# Altium schematic sheet Power.SchDoc (part 2 of 2)
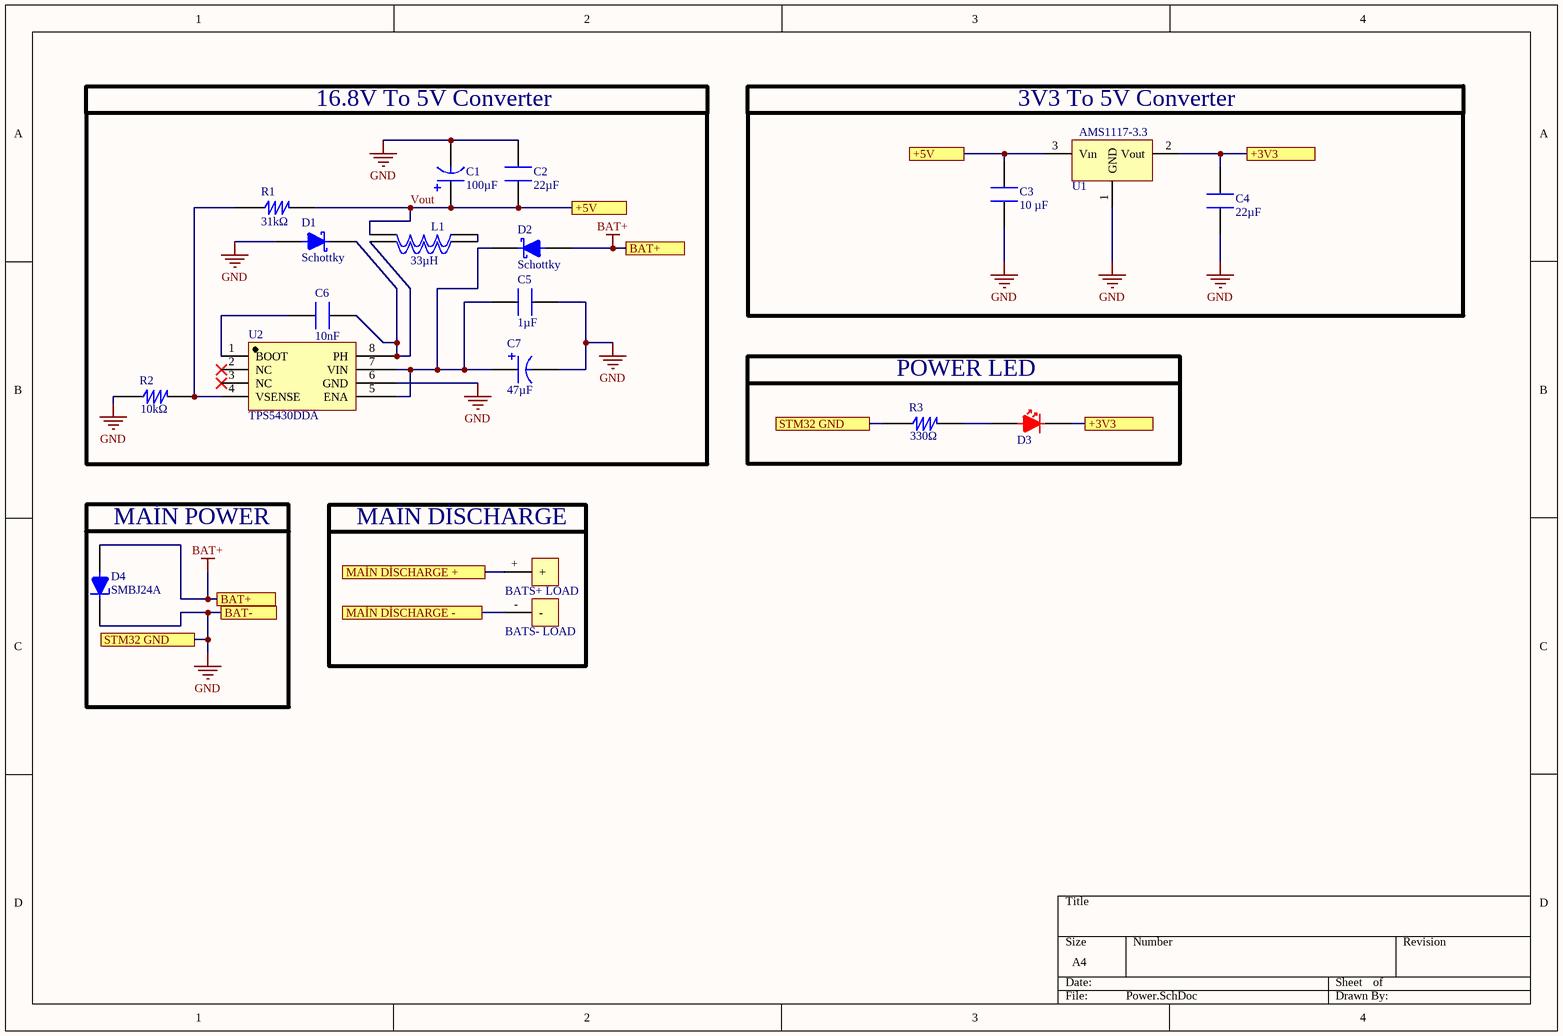
[diagram p1: Power.SchDoc]

## Library data of the parts (continued)
R2 = RES 10K OHM 1/10W 0603: RES 10K OHM 1% 1/10W 0603; Manufacturer: Stackpole Electronics; Max Power Dissipation: 100mW; Temperature Coefficient: 100ppm/°C; Voltage Rating: 75V; Supplier: Arrow Electronics; Supplier Part Number: RMCF0603FT10K0; Manufacturer Part Number: RMCF0603FT10K0; RoHS: Compliant; Category: Chip SMD Resistors; Stock: 2390000; Pricing: 50000=0,0018 (USD); Case/Package: 0603; Case Code (Imperial): 0603; Case Code (Metric): 1608; China RoHS: Non-Compliant; Composition: Thick Film; Contact Plating: Tin; Depth: 800µm; Features: Automotive AEC-Q200; Height: 450µm; Lead Free: Lead Free; Length: 1.55mm; Lifecycle Status: Production; Max Operating Temperature: 155°C; Military Standard: Not; Min Operating Temperature: -55°C; Mounting Technology: Surface Mount; Number of Terminals: 2; Number of Terminations: 2; Packaging: Cut Tape (CT); Power Dissipation: 100mW; Power Rating: 100mW; Radiation Hardening: No; REACH SVHC: Yes; Schedule B: 8533210045, 8533210045|8533210045, 8533210045|8533210045|8533210045, 8533210045|8533210045|8533210045|8533210045; Tolerance: 1%; Width: 800µm; Working Voltage: 75V; ComponentLink1URL: https://datasheet.octopart.com:443/RMCF0603FT10K0-Stackpole-Electronics-datasheet-182148065.pdf?src-supplier=IHS; ComponentLink1Description: https://datasheet.octopart.com:443/RMCF0603FT10K0-Stackpole-Electronics-datasheet-182148065.pdf?src-supplier=IHS; ComponentLink2URL: https://datasheet.octopart.com:443/RMCF0603FT10K0-Stackpole-Electronics-datasheet-28504820.pdf?src-supplier=Upverter; ComponentLink2Description: https://datasheet.octopart.com:443/RMCF0603FT10K0-Stackpole-Electronics-datasheet-28504820.pdf?src-supplier=Upverter; ComponentLink3URL: https://datasheet.octopart.com:443/RMCF0603FT10K0-Stackpole-Electronics-datasheet-141193804.pdf?src-supplier=Stackpole+Electronics; ComponentLink3Description: https://datasheet.octopart.com:443/RMCF0603FT10K0-Stackpole-Electronics-datasheet-141193804.pdf?src-supplier=Stackpole+Electronics; ComponentLink4URL: https://datasheet.octopart.com:443/RMCF0603FT10K0-Stackpole-Electronics-datasheet-62091608.pdf?src-supplier=Stackpole+Electronics; ComponentLink4Description: https://datasheet.octopart.com:443/RMCF0603FT10K0-Stackpole-Electronics-datasheet-62091608.pdf?src-supplier=Stackpole+Electronics; ComponentLink5URL: https://datasheet.octopart.com:443/RMCF0603FT10K0-Stackpole-Electronics-datasheet-12534581.pdf?src-supplier=Stackpole+Electronics; ComponentLink5Description: https://datasheet.octopart.com:443/RMCF0603FT10K0-Stackpole-Electronics-datasheet-12534581.pdf?src-supplier=Stackpole+Electronics; ComponentLink6URL: https://datasheet.octopart.com:443/RMCF0603FT10K0-Stackpole-Electronics-datasheet-10788263.pdf?src-supplier=Stackpole+Electronics; ComponentLink6Description: https://datasheet.octopart.com:443/RMCF0603FT10K0-Stackpole-Electronics-datasheet-10788263.pdf?src-supplier=Stackpole+Electronics; ComponentLink7URL: https://datasheet.octopart.com:443/RMCF0603FT10K0-Stackpole-Electronics-datasheet-155966809.pdf?src-supplier=Electro+Sonic; ComponentLink7Description: https://datasheet.octopart.com:443/RMCF0603FT10K0-Stackpole-Electronics-datasheet-155966809.pdf?src-supplier=Electro+Sonic; ComponentLink8URL: https://datasheet.octopart.com:443/RMCF0603FT10K0-Stackpole-Electronics-datasheet-189104164.pdf?src-supplier=Master+Electronics; ComponentLink8Description: https://datasheet.octopart.com:443/RMCF0603FT10K0-Stackpole-Electronics-datasheet-189104164.pdf?src-supplier=Master+Electronics; ComponentLink9URL: https://datasheet.octopart.com:443/RMCF0603FT10K0-Stackpole-Electronics-datasheet-154799224.pdf?src-supplier=Master+Electronics; ComponentLink9Description: https://datasheet.octopart.com:443/RMCF0603FT10K0-Stackpole-Electronics-datasheet-154799224.pdf?src-supplier=Master+Electronics; ComponentLink10URL: https://datasheet.octopart.com:443/RMCF0603FT10K0-Stackpole-Electronics-datasheet-11546843.pdf?src-supplier=Arrow+Electronics; ComponentLink10Description: https://datasheet.octopart.com:443/RMCF0603FT10K0-Stackpole-Electronics-datasheet-11546843.pdf?src-supplier=Arrow+Electronics; ComponentLink11URL: https://datasheet.octopart.com:443/RMCF0603FT10K0-Stackpole-Electronics-datasheet-11547379.pdf?src-supplier=Future+Electronics; ComponentLink11Description: https://datasheet.octopart.com:443/RMCF0603FT10K0-Stackpole-Electronics-datasheet-11547379.pdf?src-supplier=Future+Electronics; ComponentLink12URL: https://datasheet.octopart.com:443/RMCF0603FT10K0-Stackpole-Electronics-datasheet-8359789.pdf?src-supplier=Future+Electronics; ComponentLink12Description: https://datasheet.octopart.com:443/RMCF0603FT10K0-Stackpole-Electronics-datasheet-8359789.pdf?src-supplier=Future+Electronics; ComponentLink13URL: https://datasheet.octopart.com:443/RMCF0603FT10K0-Stackpole-Electronics-datasheet-8324226.pdf?src-supplier=Future+Electronics; ComponentLink13Description: https://datasheet.octopart.com:443/RMCF0603FT10K0-Stackpole-Electronics-datasheet-8324226.pdf?src-supplier=Future+Electronics; ComponentLink14URL: http://sigma.octopart.com:80/15940719/materials_sheet/Stackpole-Electronics-RMCF0603FT10K0.pdf?src-supplier=Compliance+Statements; ComponentLink14Description: http://sigma.octopart.com:80/15940719/materials_sheet/Stackpole-Electronics-RMCF0603FT10K0.pdf?src-supplier=Compliance+Statements; ComponentLink15URL: http://sigma.octopart.com:80/141158211/reach_statement/Stackpole-Electronics-RMCF0603FT10K0.pdf?src-supplier=Compliance+Statements; ComponentLink15Description: http://sigma.octopart.com:80/141158211/reach_statement/Stackpole-Electronics-RMCF0603FT10K0.pdf?src-supplier=Compliance+Statements; ComponentLink16URL: http://sigma.octopart.com:80/141158212/rohs_statement/Stackpole-Electronics-RMCF0603FT10K0.pdf?src-supplier=Compliance+Statements; ComponentLink16Description: http://sigma.octopart.com:80/141158212/rohs_statement/Stackpole-Electronics-RMCF0603FT10K0.pdf?src-supplier=Compliance+Statements
R3 = RES 330 OHM 1/10W 0603: 330 Ohms ±1% 0.1W, 1/10W Chip Resistor 0603 (1608 Metric) Thick Film; Manufacturer: TE Connectivity; Manufacturer Part Number: 1622918-1; Manufacturer Lifecycle Status: ACTIVE; Number of Resistors: 1; Operating Supply Voltage: 50V; Power Dissipation: 100mW; Temperature Coefficient: 100ppm/°C; Supplier: Farnell; Supplier Part Number: 3399578; RoHS: Compliant; Category: Chip SMD Resistors; Stock: 16155; Pricing: 10=0,0125, 250=0,0066, 1000=0,0044, 5000=0,0038, 10000=0,0028, 20000=0,0027 (EUR); Case/Package: 0603; Case Code (Imperial): 0603; Case Code (Metric): 1608; China RoHS: Non-Compliant; Composition: Thick Film; Depth: 800µm; ELV: Compliant; Height: 450µm; Length: 1.6mm; Lifecycle Status: Production; Max Operating Temperature: 125°C; Min Operating Temperature: -55°C; Mounting Technology: Surface Mount; Number of Terminals: 2; Number of Terminations: 2; Packaging: Tape & Reel (TR); Power Rating: 100mW; Radiation Hardening: No; REACH SVHC: Yes; Schedule B: 8533210045, 8533210090, 8533210090|8533210090, 8533210090|8533210090|8533210090; Termination: Solder; Tolerance: 1%; Voltage Rating: 50V; Width: 800µm; Working Voltage: 50V; ComponentLink1URL: https://datasheet.octopart.com:443/1622918-1-TE-Connectivity-datasheet-177732131.pdf?src-supplier=JRH+Electronics; ComponentLink1Description: https://datasheet.octopart.com:443/1622918-1-TE-Connectivity-datasheet-177732131.pdf?src-supplier=JRH+Electronics; ComponentLink2URL: https://datasheet.octopart.com:443/1622918-1-TE-Connectivity-datasheet-11120284.pdf?src-supplier=Farnell; ComponentLink2Description: https://datasheet.octopart.com:443/1622918-1-TE-Connectivity-datasheet-11120284.pdf?src-supplier=Farnell; ComponentLink3URL: https://datasheet.octopart.com:443/CRG0603F330R-TE-Connectivity-datasheet-182172479.pdf?src-supplier=IHS; ComponentLink3Description: https://datasheet.octopart.com:443/CRG0603F330R-TE-Connectivity-datasheet-182172479.pdf?src-supplier=IHS; ComponentLink4URL: https://datasheet.octopart.com:443/1622918-1-TE-Connectivity---AMP-datasheet-11120141.pdf?src-supplier=Master+Electronics; ComponentLink4Description: https://datasheet.octopart.com:443/1622918-1-TE-Connectivity---AMP-datasheet-11120141.pdf?src-supplier=Master+Electronics; ComponentLink5URL: https://datasheet.octopart.com:443/1622918-1-TE-Connectivity---AMP-datasheet-128558484.pdf?src-supplier=Master+Electronics; ComponentLink5Description: https://datasheet.octopart.com:443/1622918-1-TE-Connectivity---AMP-datasheet-128558484.pdf?src-supplier=Master+Electronics; ComponentLink6URL: https://datasheet.octopart.com:443/1622918-1-TE-Connectivity---AMP-datasheet-189108518.pdf?src-supplier=Master+Electronics; ComponentLink6Description: https://datasheet.octopart.com:443/1622918-1-TE-Connectivity---AMP-datasheet-189108518.pdf?src-supplier=Master+Electronics; ComponentLink7URL: https://datasheet.octopart.com:443/1622918-1-TE-Connectivity---AMP-datasheet-44624597.pdf?src-supplier=TE+Connectivity; ComponentLink7Description: https://datasheet.octopart.com:443/1622918-1-TE-Connectivity---AMP-datasheet-44624597.pdf?src-supplier=TE+Connectivity; ComponentLink8URL: https://datasheet.octopart.com:443/1622918-1-TE-Connectivity-datasheet-14513272.pdf?src-supplier=TE+Connectivity; ComponentLink8Description: https://datasheet.octopart.com:443/1622918-1-TE-Connectivity-datasheet-14513272.pdf?src-supplier=TE+Connectivity; ComponentLink9URL: https://datasheet.octopart.com:443/1622918-1-TE-Connectivity-datasheet-177731251.pdf?src-supplier=Burklin+Elektronik; ComponentLink9Description: https://datasheet.octopart.com:443/1622918-1-TE-Connectivity-datasheet-177731251.pdf?src-supplier=Burklin+Elektronik; ComponentLink10URL: https://datasheet.octopart.com:443/CRG0603F330R-TE-Connectivity-datasheet-111046813.pdf?src-supplier=RS+(Formerly+Allied+Electronics); ComponentLink10Description: https://datasheet.octopart.com:443/CRG0603F330R-TE-Connectivity-datasheet-111046813.pdf?src-supplier=RS+(Formerly+Allied+Electronics); ComponentLink11URL: https://datasheet.octopart.com:443/CRG0603F330R-TE-Connectivity-datasheet-20739855.pdf?src-supplier=RS+(Formerly+Allied+Electronics); ComponentLink11Description: https://datasheet.octopart.com:443/CRG0603F330R-TE-Connectivity-datasheet-20739855.pdf?src-supplier=RS+(Formerly+Allied+Electronics); ComponentLink12URL: https://datasheet.octopart.com:443/CRG0603F330R-Tyco-Electronics-datasheet-9643492.pdf?src-supplier=RS+(Formerly+Allied+Electronics); ComponentLink12Description: https://datasheet.octopart.com:443/CRG0603F330R-Tyco-Electronics-datasheet-9643492.pdf?src-supplier=RS+(Formerly+Allied+Electronics); ComponentLink13URL: http://sigma.octopart.com:80/14513267/rohs_certificate/Tyco-Electronics-CRG0603F330R.pdf?src-supplier=Compliance+Statements; ComponentLink13Description: http://sigma.octopart.com:80/14513267/rohs_certificate/Tyco-Electronics-CRG0603F330R.pdf?src-supplier=Compliance+Statements; ComponentLink14URL: http://sigma.octopart.com:80/38872715/materials_sheet/TE-Connectivity-CRG0603F330R.pdf?src-supplier=Compliance+Statements; ComponentLink14Description: http://sigma.octopart.com:80/38872715/materials_sheet/TE-Connectivity-CRG0603F330R.pdf?src-supplier=Compliance+Statements; ComponentLink15URL: http://sigma.octopart.com:80/78339115/materials_sheet/TE-Connectivity-CRG0603F330R.pdf?src-supplier=Compliance+Statements; ComponentLink15Description: http://sigma.octopart.com:80/78339115/materials_sheet/TE-Connectivity-CRG0603F330R.pdf?src-supplier=Compliance+Statements
U1 = AMS1117-3.3: IC REG LINEAR 3.3V 1A SOT-223-3L; Manufacturer: ams; Max Junction Temperature (Tj): 125°C; Number of Circuits: 1; Voltage Tolerance: 3%; Supplier: Bison Technologies; RoHS: Compliant; Category: LDO Voltage Regulators; Stock: 375; Pricing: 100=0,1, 1000=0,1, 10000=0,1 (USD); Height - Seated (Max): 1.8mm; Length: 6.505mm; Number of Terminals: 3; REACH SVHC: Yes; Terminal Pitch: 2.29mm; Width: 3.505mm; ComponentLink1URL: https://datasheet.octopart.com:443/AMS1117-3.3-ams-datasheet-31830847.pdf?src-supplier=IHS; ComponentLink1Description: https://datasheet.octopart.com:443/AMS1117-3.3-ams-datasheet-31830847.pdf?src-supplier=IHS; Manufacturer Part Number: AMS1117-3.3
U2 = TPS5430DDA: 5.5V to 36V Input, 3A, 500kHz Step-Down Converter 8-SO PowerPAD 0 to 0; Manufacturer: Texas Instruments; Manufacturer Lifecycle Status: ACTIVE; Efficiency: 95%; Frequency: 600kHz; Max Duty Cycle: 89%; Max Junction Temperature (Tj): 125°C; Max Output Voltage: 31V; Min Output Voltage: 1.22V; Nominal Supply Current: 3mA; Number of Channels: 1; Output Type: Adjustable; Synchronous Rectifier: No; Topology: Buck; Supplier: Arrow Electronics; Manufacturer Part Number: TPS5430DDA; RoHS: Compliant; Category: Voltage Regulators - Switching; Stock: 65; Pricing: 1=3,964, 10=2,831 (USD); Case/Package: SOIC; Height: 1.7mm; Lead Free: Lead Free; Length: 4.89mm; Lifecycle Status: Production; Max Supply Voltage: 36V; Max Operating Temperature: 125°C; Max Output current: 3A; Min Input Voltage: 5.5V; Min Operating Temperature: -40°C; Min Supply Voltage: 5.5V; Mounting Technology: Surface Mount; Number of Outputs: 1; Pins: 8; Operating Supply Voltage: 36V; Output Current: 3A; Output Voltage: 31V; Quiescent Current: 3mA; Radiation Hardening: No; REACH SVHC: No; Schedule B: 8542390000, 8542390000|8542390000|8542390000|8542390000|8542390000|8542390000|8542390000|8542390000|8542390000|8542390000|8542390000|8542390000|8542390000|8542390000|8542390000|8542390000|8542390000|8542390000|8542390000|8542390000|8542390000|8542390000|8542390000|85; Switching Frequency: 500kHz; Thickness: 1.48mm; Weight: 70.590313mg; Width: 3.9mm; ComponentLink1URL: https://sigma.octopart.com:443/104526336/technical_drawing/Texas-Instruments-TPS5430DDA.pdf?src-supplier=Texas+Instruments; ComponentLink1Description: https://sigma.octopart.com:443/104526336/technical_drawing/Texas-Instruments-TPS5430DDA.pdf?src-supplier=Texas+Instruments; ComponentLink2URL: https://octopart.com:443/opatz8j6/c1?t=cQwpT0IAjSvIeJNymzR49Ha4c8-Jw2GT8njN-4Wya_e5nsqySIYXgLxhkt0Jd4x2pizck7_uu0HpZBw0JIFNfGGHRxe2c5Q7M53Cns2xcEWVPkypOPmOnsio6HGwNRmBpO-tMX1aZ7VXmPql3w2aNZ9NhKChGGzvfC2q8bq69m3tcrhUwZqRyTiP4V9FR-DzuPaqnEQMs9yZrbpgcvLaaD0vy6xkV0-8W_9Zwu7IarCKUSxbgWNR-blL30e4x9bwSFN6WJrXrHFDNBoVcqvo5cL7ylo3HUXX5OruNdVRWvfm9UQ8Yujwri02A_A1AhmI0qVpc6YNiv36RxOftZXveUNmTKoyiKy0CBBmk6sHc2xMuj3RoS5LRI_jl5pMJHu_-RE&src-supplier=Texas+Instruments; ComponentLink2Description: https://octopart.com:443/opatz8j6/c1?t=cQwpT0IAjSvIeJNymzR49Ha4c8-Jw2GT8njN-4Wya_e5nsqySIYXgLxhkt0Jd4x2pizck7_uu0HpZBw0JIFNfGGHRxe2c5Q7M53Cns2xcEWVPkypOPmOnsio6HGwNRmBpO-tMX1aZ7VXmPql3w2aNZ9NhKChGGzvfC2q8bq69m3tcrhUwZqRyTiP4V9FR-DzuPaqnEQMs9yZrbpgcvLaaD0vy6xkV0-8W_9Zwu7IarCKUSxbgWNR-blL30e4x9bwSFN6WJrXrHFDNBoVcqvo5cL7ylo3HUXX5OruNdVRWvfm9UQ8Yujwri02A_A1AhmI0qVpc6YNiv36RxOftZXveUNmTKoyiKy0CBBmk6sHc2xMuj3RoS5LRI_jl5pMJHu_-RE&src-supplier=Texas+Instruments; ComponentLink3URL: https://datasheet.octopart.com:443/TPS5430DDA-Texas-Instruments-datasheet-34154659.pdf?src-supplier=Texas+Instruments; ComponentLink3Description: https://datasheet.octopart.com:443/TPS5430DDA-Texas-Instruments-datasheet-34154659.pdf?src-supplier=Texas+Instruments; ComponentLink4URL: https://datasheet.octopart.com:443/TPS5430DDA-Texas-Instruments-datasheet-17423535.pdf?src-supplier=Texas+Instruments; ComponentLink4Description: https://datasheet.octopart.com:443/TPS5430DDA-Texas-Instruments-datasheet-17423535.pdf?src-supplier=Texas+Instruments; ComponentLink5URL: https://datasheet.octopart.com:443/TPS5430DDA-Texas-Instruments-datasheet-13479706.pdf?src-supplier=Texas+Instruments; ComponentLink5Description: https://datasheet.octopart.com:443/TPS5430DDA-Texas-Instruments-datasheet-13479706.pdf?src-supplier=Texas+Instruments; ComponentLink6URL: https://sigma.octopart.com:443/49250132/technical_drawing/Texas-Instruments-TPS5430DDA.pdf?src-supplier=Texas+Instruments; ComponentLink6Description: https://sigma.octopart.com:443/49250132/technical_drawing/Texas-Instruments-TPS5430DDA.pdf?src-supplier=Texas+Instruments; ComponentLink7URL: https://datasheet.octopart.com:443/TPS5430DDA-Texas-Instruments-datasheet-10258285.pdf?src-supplier=Texas+Instruments; ComponentLink7Description: https://datasheet.octopart.com:443/TPS5430DDA-Texas-Instruments-datasheet-10258285.pdf?src-supplier=Texas+Instruments; ComponentLink8URL: https://datasheet.octopart.com:443/TPS5430DDA-Texas-Instruments-datasheet-151806.pdf?src-supplier=Texas+Instruments; ComponentLink8Description: https://datasheet.octopart.com:443/TPS5430DDA-Texas-Instruments-datasheet-151806.pdf?src-supplier=Texas+Instruments; ComponentLink9URL: https://datasheet.octopart.com:443/TPS5430DDA-Texas-Instruments-datasheet-136392.pdf?src-supplier=Texas+Instruments; ComponentLink9Description: https://datasheet.octopart.com:443/TPS5430DDA-Texas-Instruments-datasheet-136392.pdf?src-supplier=Texas+Instruments; ComponentLink10URL: https://datasheet.octopart.com:443/TPS5430DDA-Texas-Instruments-datasheet-37140813.pdf?src-supplier=element14+APAC; ComponentLink10Description: https://datasheet.octopart.com:443/TPS5430DDA-Texas-Instruments-datasheet-37140813.pdf?src-supplier=element14+APAC; ComponentLink11URL: https://datasheet.octopart.com:443/TPS5430DDA-Texas-Instruments-datasheet-66810009.pdf?src-supplier=element14+APAC; ComponentLink11Description: https://datasheet.octopart.com:443/TPS5430DDA-Texas-Instruments-datasheet-66810009.pdf?src-supplier=element14+APAC; ComponentLink12URL: https://datasheet.octopart.com:443/TPS5430DDA.-Texas-Instruments-datasheet-62292585.pdf?src-supplier=element14+APAC; ComponentLink12Description: https://datasheet.octopart.com:443/TPS5430DDA.-Texas-Instruments-datasheet-62292585.pdf?src-supplier=element14+APAC; ComponentLink13URL: https://datasheet.octopart.com:443/TPS5430DDA.-Texas-Instruments-datasheet-32026778.pdf?src-supplier=element14+APAC; ComponentLink13Description: https://datasheet.octopart.com:443/TPS5430DDA.-Texas-Instruments-datasheet-32026778.pdf?src-supplier=element14+APAC; ComponentLink14URL: https://datasheet.octopart.com:443/TPS5430DDA-Texas-Instruments-datasheet-21262768.pdf?src-supplier=element14+APAC; ComponentLink14Description: https://datasheet.octopart.com:443/TPS5430DDA-Texas-Instruments-datasheet-21262768.pdf?src-supplier=element14+APAC; ComponentLink15URL: https://datasheet.octopart.com:443/TPS5430DDA-Texas-Instruments-datasheet-14439094.pdf?src-supplier=Upverter; ComponentLink15Description: https://datasheet.octopart.com:443/TPS5430DDA-Texas-Instruments-datasheet-14439094.pdf?src-supplier=Upverter; ComponentLink16URL: https://datasheet.octopart.com:443/TPS5430DDA-Texas-Instruments-datasheet-23715064.pdf?src-supplier=Newark; ComponentLink16Description: https://datasheet.octopart.com:443/TPS5430DDA-Texas-Instruments-datasheet-23715064.pdf?src-supplier=Newark; ComponentLink17URL: https://datasheet.octopart.com:443/TPS5430DDA-Texas-Instruments-datasheet-11761703.pdf?src-supplier=Newark; ComponentLink17Description: https://datasheet.octopart.com:443/TPS5430DDA-Texas-Instruments-datasheet-11761703.pdf?src-supplier=Newark; ComponentLink18URL: https://datasheet.octopart.com:443/TPS5430DDA-Texas-Instruments-datasheet-14167055.pdf?src-supplier=iiiC; ComponentLink18Description: https://datasheet.octopart.com:443/TPS5430DDA-Texas-Instruments-datasheet-14167055.pdf?src-supplier=iiiC; ComponentLink19URL: https://datasheet.octopart.com:443/TPS5430DDA-Texas-Instruments-datasheet-8428127.pdf?src-supplier=Jameco; ComponentLink19Description: https://datasheet.octopart.com:443/TPS5430DDA-Texas-Instruments-datasheet-8428127.pdf?src-supplier=Jameco; ComponentLink20URL: http://sigma.octopart.com:80/reach_statement/Texas-Instruments-company-64.pdf?src-supplier=Compliance+Statements; ComponentLink20Description: http://sigma.octopart.com:80/reach_statement/Texas-Instruments-company-64.pdf?src-supplier=Compliance+Statements; ComponentLink21URL: http://sigma.octopart.com:80/conflict_mineral_statement/Texas-Instruments-company-63.pdf?src-supplier=Compliance+Statements; ComponentLink21Description: http://sigma.octopart.com:80/conflict_mineral_statement/Texas-Instruments-company-63.pdf?src-supplier=Compliance+Statements; Supplier Part Number: TPS5430DDA